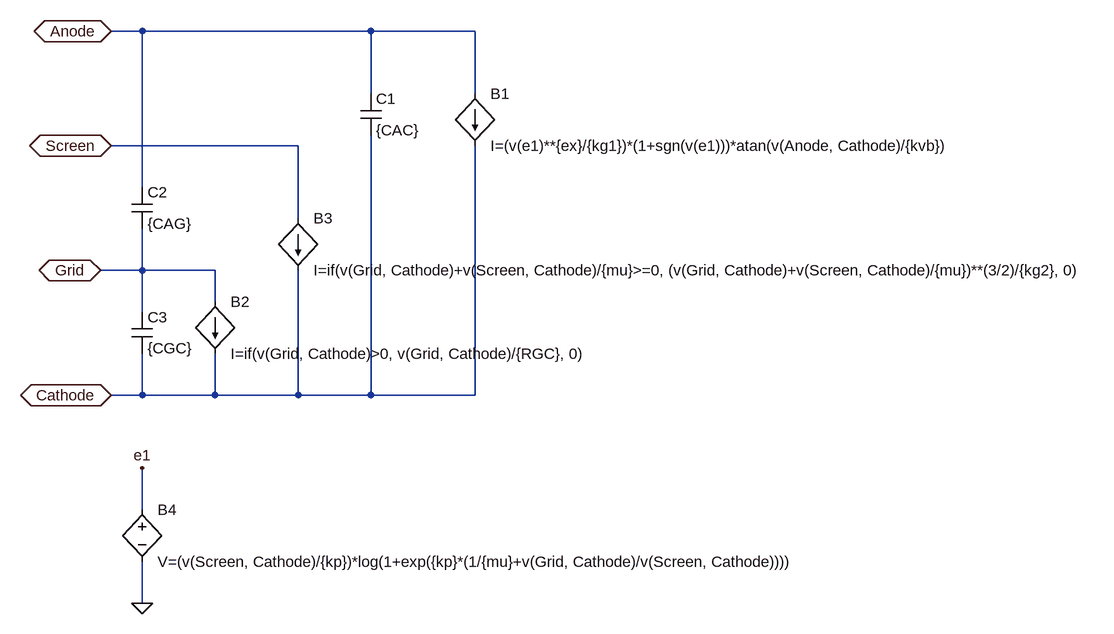
[diagram p0: schematic tetrode.asc]
tetrode.asc, the LTspice schematic file:
Version 4
SHEET 1 2796 708
WIRE 96 -192 48 -192
WIRE 448 -192 96 -192
WIRE 608 -192 448 -192
WIRE 448 -96 448 -192
WIRE 608 -96 608 -192
WIRE 336 -16 48 -16
WIRE 96 48 96 -192
WIRE 336 96 336 -16
WIRE 96 176 96 112
WIRE 96 176 32 176
WIRE 208 176 96 176
WIRE 208 224 208 176
WIRE 96 240 96 176
WIRE 96 368 96 304
WIRE 96 368 48 368
WIRE 208 368 208 304
WIRE 208 368 96 368
WIRE 336 368 336 176
WIRE 336 368 208 368
WIRE 448 368 448 -32
WIRE 448 368 336 368
WIRE 608 368 608 -16
WIRE 608 368 448 368
WIRE 96 544 96 480
WIRE 96 688 96 624
FLAG 48 -192 Anode
IOPIN 48 -192 BiDir
FLAG 32 176 Grid
IOPIN 32 176 BiDir
FLAG 48 368 Cathode
IOPIN 48 368 BiDir
FLAG 96 480 e1
FLAG 96 688 0
FLAG 48 -16 Screen
IOPIN 48 -16 BiDir
SYMBOL bi 608 -96 R0
SYMATTR InstName B1
SYMATTR Value I=(v(e1)**{ex}/{kg1})*(1+sgn(v(e1)))*atan(v(Anode, Cathode)/{kvb})
SYMBOL bi 208 224 R0
SYMATTR InstName B2
SYMATTR Value I=if(v(Grid, Cathode)>0, v(Grid, Cathode)/{RGC}, 0)
SYMBOL cap 432 -96 R0
SYMATTR InstName C1
SYMATTR Value {CAC}
SYMBOL cap 80 48 R0
SYMATTR InstName C2
SYMATTR Value {CAG}
SYMBOL cap 80 240 R0
SYMATTR InstName C3
SYMATTR Value {CGC}
SYMBOL bv 96 528 R0
SYMATTR InstName B4
SYMATTR Value V=(v(Screen, Cathode)/{kp})*log(1+exp({kp}*(1/{mu}+v(Grid, Cathode)/v(Screen, Cathode))))
SYMBOL bi 336 96 R0
SYMATTR InstName B3
SYMATTR Value I=if(v(Grid, Cathode)+v(Screen, Cathode)/{mu}>=0, (v(Grid, Cathode)+v(Screen, Cathode)/{mu})**(3/2)/{kg2}, 0)

The netlist it stands for:
* tetrode.asc
B1 Anode Cathode I=(v(e1)**{ex}/{kg1})*(1+sgn(v(e1)))*atan(v(Anode, Cathode)/{kvb})
B2 Grid Cathode I=if(v(Grid, Cathode)>0, v(Grid, Cathode)/{RGC}, 0)
C1 Anode Cathode {CAC}
C2 Anode Grid {CAG}
C3 Grid Cathode {CGC}
B4 e1 0 V=(v(Screen, Cathode)/{kp})*log(1+exp({kp}*(1/{mu}+v(Grid, Cathode)/v(Screen, Cathode))))
B3 Screen Cathode I=if(v(Grid, Cathode)+v(Screen, Cathode)/{mu}>=0, (v(Grid, Cathode)+v(Screen, Cathode)/{mu})**(3/2)/{kg2}, 0)
.backanno
.end